# Altium schematic sheet GPS_LORA_IMU.SchDoc
size A; SheetNumber: 3; SheetTotal: 3
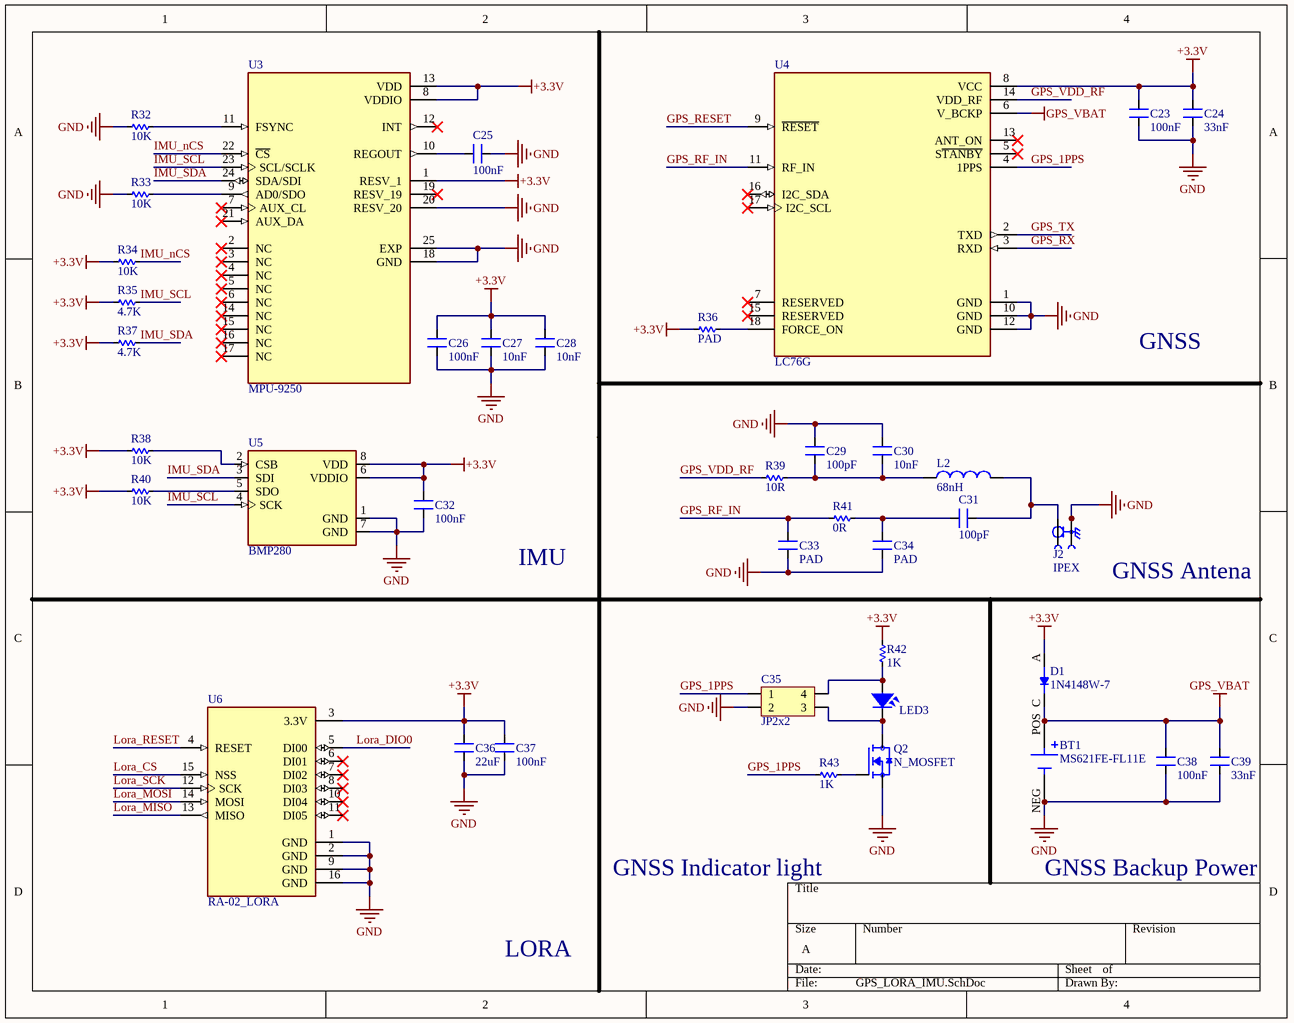
[diagram p0: GPS_LORA_IMU.SchDoc]

## Parts
BT1  MS621FE-FL11E  [BAT_MS621FE-FL11E]
C23  100nF  [CN-SMD-0603]
C24  33nF  [CN-SMD-0603]
C25  100nF  [CN-SMD-0603]
C26  100nF  [CN-SMD-0603]
C27  10nF  [CN-SMD-0603]
C28  10nF  [CN-SMD-0603]
C29  100pF  [CN-SMD-0603]
C30  10nF  [CN-SMD-0603]
C31  100pF  [CN-SMD-0603]
C32  100nF  [CN-SMD-0603]
C33  PAD  [PAD-CAP-SMD-0603]
C34  PAD  [PAD-CAP-SMD-0603]
C35  JP2x2  [JP2-D2T]
C36  22uF  [CN-SMD-1206]
C37  100nF  [CN-SMD-0603]
C38  100nF  [CN-SMD-0603]
C39  33nF  [CN-SMD-0603]
D1  1N4148W-7  [SOD3715X135N]
J2  IPEX  [IPEX_20279-001E-03]
L2  68nH  [SMD_Inductor_0603]
LED3  LED  [LED-0805-Green]  (value not drawn)
Q2  N_MOSFET  [SOT-23-3]
R32  10K  [RES-SMD-0603]
R33  10K  [RES-SMD-0603]
R34  10K  [RES-SMD-0603]
R35  4.7K  [RES-SMD-0603]
R36  PAD  [PAD-RES-SMD-0603]
R37  4.7K  [RES-SMD-0603]
R38  10K  [RES-SMD-0603]
R39  10R  [RES-SMD-0603]
R40  10K  [RES-SMD-0603]
R41  0R  [RES-SMD-0603]
R42  1K  [RES-SMD-0603]
R43  1K  [RES-SMD-0603]
U3  MPU-9250  [QFN40P300X300X105-25N]
U4  LC76G  [XCVR_LC76G]
U5  BMP280  [XDCR_BMP280]
U6  RA-02_LORA  [MODULE_RA-02_LORA]

## Nets
+3.3V: C23.2 C24.2 C26.2 C27.2 C28.2 C32.2 C36.2 C37.2 D1.A R34.1 R35.1 R36.2 R37.1 R38.2 R40.2 R42.2 U3.1(RESV_1) U3.8(VDDIO) U3.13(VDD) U4.8(VCC) U5.6(VDDIO) U5.8(VDD) U6.3(3.3V)
GND: BT1.NEG C23.1 C24.1 C25.2 C26.1 C27.1 C28.1 C29.2 C30.2 C32.1 C33.2 C34.2 C35.2 C36.1 C37.1 C38.1 C39.1 J2.2(GROUND) J2.3(GROUND) Q2.2(S) R32.2 R33.2 U3.18(GND) U3.20(RESV_20) U3.25(EXP) U4.1(GND) U4.10(GND) U4.12(GND) U5.1(GND) U5.7(GND) U6.1(GND) U6.2(GND) U6.9(GND) U6.16(GND)
GPS_VBAT: BT1.POS C38.2 C39.2 D1.C(K) U4.6(V_BCKP)
GPS_1PPS: C35.1 R43.1 U4.4(1PPS)
GPS_RESET: U4.9(~{RESET})
GPS_RF_IN: C33.1 R41.2 U4.11(RF_IN)
GPS_RX: U4.3(RXD)
GPS_TX: U4.2(TXD)
GPS_VDD_RF: R39.2 U4.14(VDD_RF)
IMU_nCS: R34.2 U3.22(~{CS})
IMU_SCL: R35.2 U3.23(SCL/SCLK) U5.4(SCK)
IMU_SDA: R37.2 U3.24(SDA/SDI) U5.3(SDI)
Lora_CS: U6.15(NSS)
Lora_DIO0: U6.5(DI00)
Lora_MISO: U6.13(MISO)
Lora_MOSI: U6.14(MOSI)
Lora_RESET: U6.4(RESET)
Lora_SCK: U6.12(SCK)
NetC25_1: C25.1 U3.10(REGOUT)
NetC29_1: C29.1 C30.1 L2.1 R39.1
NetC31_1: C31.1 J2.1(SIGNAL) L2.2
NetC31_2: C31.2 C34.1 R41.1
NetC35_3: C35.3 LED3.2 Q2.3(D)
NetC35_4: C35.4 LED3.1 R42.1
NetQ2_1: Q2.1(G) R43.2
NetR32_1: R32.1 U3.11(FSYNC)
NetR33_1: R33.1 U3.9(AD0/SDO)
NetR36_1: R36.1 U4.18(FORCE_ON)
NetR38_1: R38.1 U5.2(CSB)
NetR40_1: R40.1 U5.5(SDO)

Not connected (* = marked no-connect by the designer): U3 2(NC)* 3(NC)* 4(NC)* 5(NC)* 6(NC)* 7(AUX_CL)* 12(INT)* 14(NC)* 15(NC)* 16(NC)* 17(NC)* 19(RESV_19)* 21(AUX_DA)*; U4 5(S~{TANBY})* 7(RESERVED)* 13(ANT_ON)* 15(RESERVED)* 16(I2C_SDA)* 17(I2C_SCL)*; U6 6(DI01)* 7(DI02)* 8(DI03)* 10(DI04)* 11(DI05)*

## Notes on the sheet
- GNSS
- IMU
- (near J2) GNSS Antena
- GNSS Indicator light
- GNSS Backup Power
- LORA

## Library data of the parts
BT1 = MS621FE-FL11E: Coin, 6.8mm 3 V Lithium Battery Rechargeable (Secondary) 5.5mAh; MF: Seiko Instruments; Value: *; Purchase-URL: https://pricing.snapeda.com/search/part/MS621FE-FL11E/?ref=eda; Package: QFP-128 Seiko; Availability: In Stock; Check_prices: https://www.snapeda.com/parts/MS621FE-FL11E/Seiko+Instruments/view-part/?ref=eda; Price: None; SnapEDA_Link: https://www.snapeda.com/parts/MS621FE-FL11E/Seiko+Instruments/view-part/?ref=snap; MP: MS621FE-FL11E
C23-C34 C36-C39 = Cap-SMD: Value: 33pF
C35 = JP2x2: WR-PHD 2.54 mm Dual Socket Header; Manufacturer: W¨¹rth Elektronik eiSos GmbH; partNo: 61300421821; ComponentLink1 Description: Manufacturer; ComponentLink2 Description: Datasheet; NoPins: 04; Created Date: 29 March 2013; ComponentLink1URL: http://www.we-online.com; ComponentLink2URL: http://katalog.we-online.de/em/datasheet/6130xx21821.pdf; Created by: Karrer Zheng
D1 = 1N4148W-7: Diode Standard 100 V 300mA (DC) Surface Mount SOD-123; MF: Diodes Inc.; SnapEDA_Link: https://www.snapeda.com/parts/1N4148W-7/Diodes+Inc./view-part/?ref=snap; Package: SOD-123 Fairchild Semiconductor; MP: 1N4148W-7; Check_prices: https://www.snapeda.com/parts/1N4148W-7/Diodes+Inc./view-part/?ref=eda; Purchase-URL: https://pricing.snapeda.com/search/part/1N4148W-7/?ref=eda; Price: None; Value: *; Availability: In Stock
J2 = IPEX: 1 POS Vertical SMD Small form factor with big performance through 6 GHz connector,MHF, RF, micro-coaxial MHF I Receptacle; MF: I-PEX; MP: 20279-001E-03; SnapEDA_Link: https://www.snapeda.com/parts/20279-001E-03/I-PEX/view-part/?ref=snap; Package: None; Value: *; Check_prices: https://www.snapeda.com/parts/20279-001E-03/I-PEX/view-part/?ref=eda
L2 = SMD-Wire-Inductor: INDUCTOR wire-wound; MP: LQW2BAN68NG00L; Package: None; Price: None; Value: *; Availability: Unavailable
LED3 = LED SMD: Value: LED 3 - 5 ly 2 Colour
Q2 = N_MOSFET: MF: Vishay Siliconix; MP: SI2306BDS-T1-GE3; SnapEDA_Link: https://www.snapeda.com/parts/SI2306BDS-T1-GE3/Vishay/view-part/?ref=snap; Package: SOT-23-3 Vishay Siliconix; Value: *; Check_prices: https://www.snapeda.com/parts/SI2306BDS-T1-GE3/Vishay/view-part/?ref=eda
R32-R35 R37 R38 R40 = Res-SMD: Manufacturer: Generic Components; Class: Passive; Published: 08/06/2000; Publisher: Altium Hobart Technology Centre
R36 R39 R41-R43 = Res-SMD: Resistor; Manufacturer: Generic Components; Class: Passive; Published: 08/06/2000; Publisher: Altium Hobart Technology Centre
U3 = MPU-9250: MPU-9250 series Accelerometer, Gyroscope, Humidity, Magnetometer, Pressure, Temperature Sensor Evaluation Board; MF: TDK InvenSense; SnapEDA_Link: https://www.snapeda.com/parts/MPU-9250/TDK+InvenSense/view-part/?ref=snap; Package: TFQFN-24 TDK InvenSense; Value: *; MP: MPU-9250; Check_prices: https://www.snapeda.com/parts/MPU-9250/TDK+InvenSense/view-part/?ref=eda
U4 = LC76G: MF: Quectel; Package: None; Price: None; Value: *; MP: LC76G; Availability: Unavailable
U5 = BMP280: BMP280 Absolute Barometric Pressure Sensor for Battery Powered Devices 2 x 2.5mm; Package: None; Availability: Unavailable; MP: BMP280; Value: *; Price: None
U6 = RA-02_LORA: Ra-02 LoRa RF M5Stack Platform Evaluation Expansion Board; Price: None; Availability: Unavailable; MP: RA-02_LORA; Value: *; Package: None